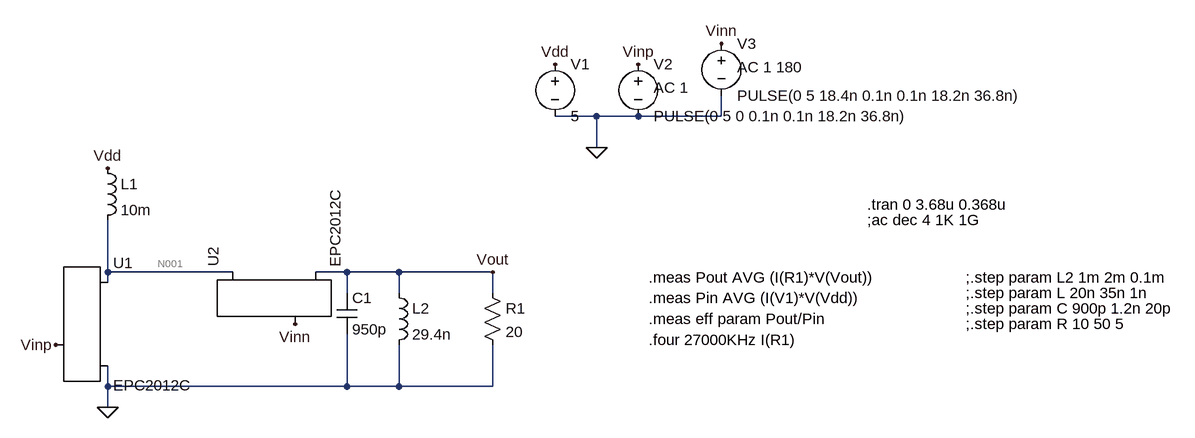
[diagram p0: schematic ClassD_CurrentSwitching.asc]
ClassD_CurrentSwitching.asc, the LTspice schematic file:
Version 4
SHEET 1 1488 680
WIRE 464 -192 400 -192
WIRE 528 -192 464 -192
WIRE 656 -192 656 -224
WIRE 656 -192 528 -192
WIRE 464 -144 464 -192
WIRE -288 48 -288 -32
WIRE -96 48 -288 48
WIRE 80 48 32 48
WIRE 160 48 80 48
WIRE 304 48 160 48
WIRE -288 64 -288 48
WIRE 80 80 80 48
WIRE 160 80 160 48
WIRE 304 80 304 48
WIRE -288 224 -288 192
WIRE 80 224 80 144
WIRE 80 224 -288 224
WIRE 160 224 160 160
WIRE 160 224 80 224
WIRE 304 224 304 160
WIRE 304 224 160 224
WIRE -288 256 -288 224
FLAG -288 256 0
FLAG 464 -144 0
FLAG 400 -272 Vdd
FLAG -288 -112 Vdd
FLAG 528 -272 Vinp
FLAG -368 160 Vinp
FLAG 656 -304 Vinn
FLAG 0 128 Vinn
FLAG 304 48 Vout
SYMBOL EPCGaN -368 160 R0
SYMATTR InstName U1
SYMATTR Value EPC2012C
SYMBOL EPCGaN 0 128 R270
SYMATTR InstName U2
SYMATTR Value EPC2012C
SYMBOL ind -304 -128 R0
SYMATTR InstName L1
SYMATTR Value 10m
SYMBOL voltage 400 -288 R0
WINDOW 123 0 0 Left 0
WINDOW 39 0 0 Left 0
SYMATTR InstName V1
SYMATTR Value 5
SYMBOL voltage 528 -288 R0
WINDOW 123 24 52 Left 2
WINDOW 39 0 0 Left 0
SYMATTR Value2 AC 1
SYMATTR InstName V2
SYMATTR Value PULSE(0 5 0 0.1n 0.1n 18.2n 36.8n)
SYMBOL ind 144 64 R0
SYMATTR InstName L2
SYMATTR Value 29.4n
SYMATTR SpiceLine Rser=0.1
SYMBOL cap 64 80 R0
SYMATTR InstName C1
SYMATTR Value 950p
SYMATTR SpiceLine Rser=0.1
SYMBOL res 288 64 R0
SYMATTR InstName R1
SYMATTR Value 20
SYMBOL voltage 656 -320 R0
WINDOW 123 24 52 Left 2
WINDOW 39 0 0 Left 0
SYMATTR Value2 AC 1 180
SYMATTR InstName V3
SYMATTR Value PULSE(0 5 18.4n 0.1n 0.1n 18.2n 36.8n)
TEXT 880 -56 Left 2 !.tran 0 3.68u 0.368u
TEXT 880 -32 Left 2 !;ac dec 4 1K 1G
TEXT 1032 80 Left 2 !;.step param L 20n 35n 1n
TEXT 544 56 Left 2 !.meas Pout AVG (I(R1)*V(Vout))
TEXT 544 88 Left 2 !.meas Pin AVG (I(V1)*V(Vdd))
TEXT 544 120 Left 2 !.meas eff param Pout/Pin
TEXT 544 152 Left 2 !.four 27000KHz I(R1)
TEXT 1032 128 Left 2 !;.step param R 10 50 5
TEXT 1032 56 Left 2 !;.step param L2 1m 2m 0.1m
TEXT 1032 104 Left 2 !;.step param C 900p 1.2n 20p

The netlist it stands for:
* ClassD_CurrentSwitching.asc
XU1 Vinp N001 0 EPC2012C
XU2 Vinn N001 Vout EPC2012C
L1 Vdd N001 10m
V1 Vdd 0 5
V2 Vinp 0 PULSE(0 5 0 0.1n 0.1n 18.2n 36.8n) AC 1
L2 Vout 0 29.4n Rser=0.1
C1 Vout 0 950p Rser=0.1
R1 Vout 0 20
V3 Vinn 0 PULSE(0 5 18.4n 0.1n 0.1n 18.2n 36.8n) AC 1 180
.tran 0 3.68u 0.368u
;ac dec 4 1K 1G
;.step param L 20n 35n 1n
.meas Pout AVG (I(R1)*V(Vout))
.meas Pin AVG (I(V1)*V(Vdd))
.meas eff param Pout/Pin
.four 27000KHz I(R1)
;.step param R 10 50 5
;.step param L2 1m 2m 0.1m
;.step param C 900p 1.2n 20p
.backanno
.end

* Results of the author's LTspice run, read from the files saved beside the schematic
* Operating Point, zero values left out:
*   V(n001) = 5 V
*   V(vout) = 210.4 nV
*   V(vdd) = 5 V
*   I(L2) = 2.104 µA
*   I(L1) = 4.301 µA
*   I(R1) = 10.52 nA
*   I(V3) = 36.39 nA
*   I(V2) = 36.39 nA
*   I(V1) = -4.301 µA
*   Ix(u1:GATEIN) = -36.39 nA
*   Ix(u1:DRAININ) = 2.151 µA
*   Ix(u1:SOURCEIN) = -2.114 µA
*   Ix(u2:GATEIN) = -36.39 nA
*   Ix(u2:DRAININ) = 2.151 µA
*   Ix(u2:SOURCEIN) = -2.114 µA
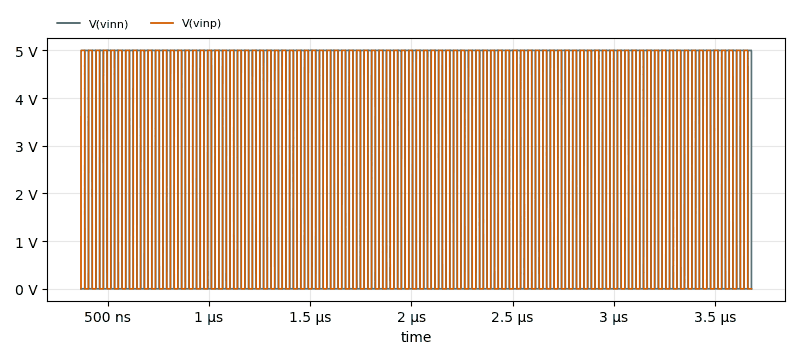
[diagram p1: Transient Analysis of ClassD_CurrentSwitching.asc, plotted from the saved traces]
* Transient Analysis, 1 run:
*   V(vinn): min 0 V, max 5 V, average 2.486 V, rms 3.523 V, last 0 V
*   V(vinp): min 0 V, max 5 V, average 2.486 V, rms 3.523 V, last 0 V
* From the log:
*   N-Period=1
*   Fourier components of I(r1)
*   DC component:-0.000193542
*   Harmonic  Frequency   Fourier   Normalized   Phase    Normalized
*    Number     [Hz]     Component   Component  [degree]  Phase [deg]
*       1     2.700e+07  4.156e-02  1.000e+00     90.99°      0.00°
*       2     5.400e+07  9.206e-05  2.215e-03    162.58°     71.58°
*       3     8.100e+07  4.313e-03  1.038e-01     88.38°     -2.61°
*       4     1.080e+08  1.161e-04  2.794e-03     86.97°     -4.02°
*       5     1.350e+08  2.450e-03  5.896e-02    133.56°     42.56°
*       6     1.620e+08  1.297e-04  3.122e-03    111.99°     21.00°
*       7     1.890e+08  1.643e-03  3.953e-02   -176.32°   -267.32°
*       8     2.160e+08  1.318e-04  3.172e-03    139.04°     48.05°
*       9     2.430e+08  1.298e-03  3.123e-02   -124.86°   -215.85°
*   Total Harmonic Distortion: 12.968207%(14.544226%)
*   pout: AVG(i(r1)*v(vout))=0.0175056 FROM 0 TO 3.312e-006
*   pin: AVG(i(v1)*v(vdd))=-0.00495837 FROM 0 TO 3.312e-006
*   eff: pout/pin=-3.53052